# Altium schematic sheet PFC.SchDoc
size A4
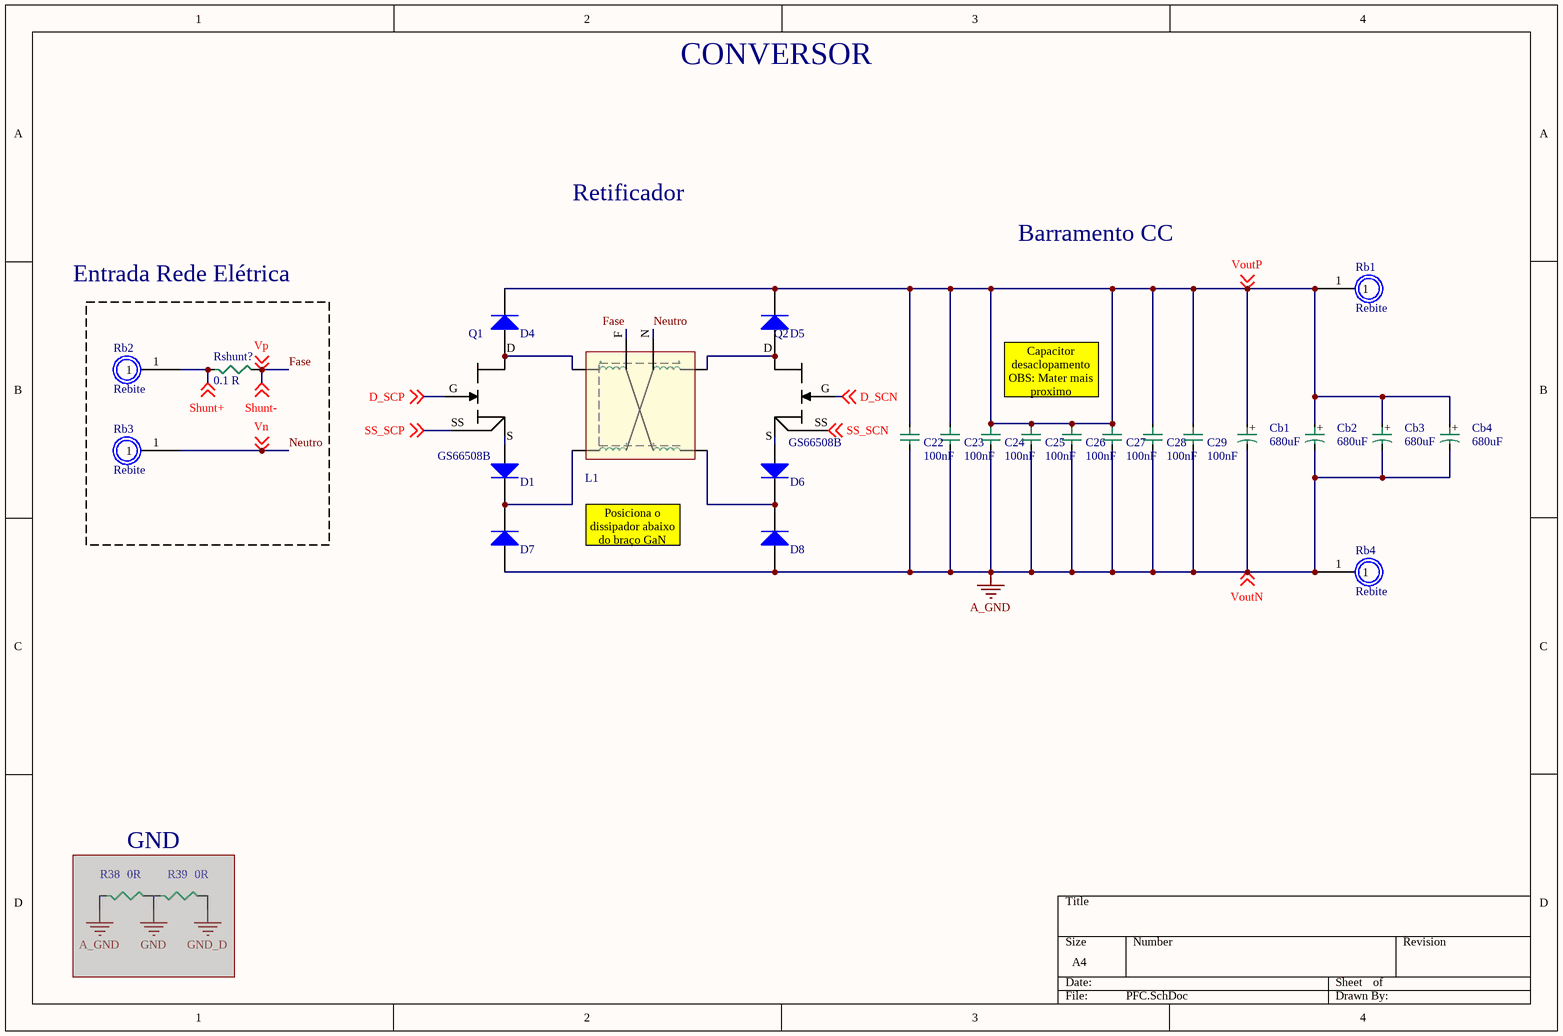
[diagram p0: PFC.SchDoc]

## Parts
C22  value 100nF  [1812C]  (hidden comment: 1812)
C23  value 100nF  [1812C]  (hidden comment: 1812)
C24  value 100nF  [1812C]  (hidden comment: 1812)
C25  value 100nF  [1812C]  (hidden comment: 1812)
C26  value 100nF  [1812C]  (hidden comment: 1812)
C27  value 100nF  [1812C]  (hidden comment: 1812)
C28  value 100nF  [1812C]  (hidden comment: 1812)
C29  value 100nF  [1812C]  (hidden comment: 1812)
Cb1  value 680uF  [CAP ALU D30 A50  DeitadoPCB]  (hidden comment: Cap 30x50 mm)
Cb2  value 680uF  [CAP ALU D30 A50  DeitadoPCBV]  (hidden comment: Cap 30x50 mm)
Cb3  value 680uF  [CAP ALU D30 A50  DeitadoPCB]  (hidden comment: Cap 30x50 mm)
Cb4  value 680uF  [CAP ALU D30 A50  DeitadoPCBV]  (hidden comment: Cap 30x50 mm)
D1  IDL12G65C5XUMA2Diode 1N40XX  [VSON4]  (value not drawn)
D4  IDL12G65C5XUMA2Diode 1N40XX  [VSON4]  (value not drawn)
D5  IDL12G65C5XUMA2Diode 1N40XX  [VSON4]  (value not drawn)
D6  IDL12G65C5XUMA2Diode 1N40XX  [VSON4]  (value not drawn)
D7  IDL12G65C5XUMA2Diode 1N40XX  [VSON4]  (value not drawn)
D8  IDL12G65C5XUMA2Diode 1N40XX  [VSON4]  (value not drawn)
L1  Indutor PFC Dissertacao  [INDUTOR DISSERTACAO]  (value not drawn)
Q1  GS66508B  [GS66508B]
Q2  GS66508B  [GS66508B]
R38  value 0R  [0805]  (hidden comment: 0805)  (masked out: inside a compile mask, not in the netlist)
R39  value 0R  [0805]  (hidden comment: 0805)  (masked out: inside a compile mask, not in the netlist)
Rb1  Rebite  [Rebite]
Rb2  Rebite  [Rebite]
Rb3  Rebite  [Rebite]
Rb4  Rebite  [Rebite]
Rshunt?  value 0.1 R  [WSHM]  (hidden comment: WSHM28189L000FEA)

## Nets
A_GND: C22.2 C23.2 C24.2 C25.2 C26.2 C27.2 C28.2 C29.2 Cb1.2 Cb2.2 Cb3.2 Cb4.2 D7.1(A) D8.1(A) Rb4.1 ; off-sheet VoutN  [also labelled VoutN]
D_SCN: Q2.G ; off-sheet D_SCN
D_SCP: Q1.G ; off-sheet D_SCP
Fase: L1.F Rshunt?.2 ; off-sheet Shunt-, off-sheet Vp  [also labelled Shunt-, Vp]
Neutro: L1.N Rb3.1 ; off-sheet Vn  [also labelled Vn]
Shunt+: Rb2.1 Rshunt?.1 ; off-sheet Shunt+
SS_SCN: Q2.SS ; off-sheet SS_SCN
SS_SCP: Q1.SS ; off-sheet SS_SCP
VoutP: C22.1 C23.1 C24.1 C25.1 C26.1 C27.1 C28.1 C29.1 Cb1.1 Cb2.1 Cb3.1 Cb4.1 D4.2(K) D5.2(K) Rb1.1 ; off-sheet VoutP
NetD1_1: D1.1(A) Q1.S
NetD1_2: D1.2(K) D7.2(K) L1.2
NetD4_1: D4.1(A) L1.1 Q1.D
NetD5_1: D5.1(A) L1.3 Q2.D
NetD6_1: D6.1(A) Q2.S
NetD6_2: D6.2(K) D8.2(K) L1.4

## Notes on the sheet
- CONVERSOR
- Retificador
- Barramento CC
- Entrada Rede Elétrica
- Capacitor desaclopamento
  OBS: Mater mais proximo
  do braço do conversor.
- Posiciona o dissipador abaixo do braço GaN
- GND
- (in symbol Capacitor ALU 30x50 mm) +

## Library data of the parts
C22-C29 = Capacitor SMD 1812
Cb1-Cb4 = Capacitor ALU 30x50 mm: Capacitor 30x50 mm; %: ±20%; Tensão: 200V
D1 D4-D8 = IDL12G65C5XUMA2: DIODE SCHOTTKY 650V 12A VSON-4; ComponentLink1Description: DIGI; ComponentLink1URL: https://www.digikey.com/product-detail/en/infineon-technologies/IDL12G65C5XUMA2/IDL12G65C5XUMA2-ND/7313875
L1 = Indutor PFC Dissertacao: Indutor; Value: 32uH
Q1 Q2 = GS66508B: GAN TRANS E-MODE 650V 30A
R38 R39 = Resistor SMD 0805 1/8 W: %: ±1%; P: 1/8W
Rshunt? = Resistor shunt SMD 7 W: 7W Chip Resistor Nonstandard Automotive AEC-Q200, Current Sense, Moisture Resistant, Pulse Withstanding Metal Element; %: ±1%; P: 3W